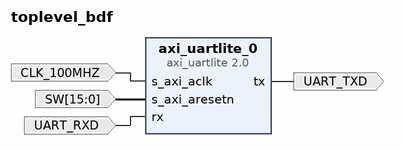
[diagram p0: block diagram of the top level]
# Vivado block design toplevel_bdf, xc7s50csga324-2, Vivado 2025.1
create_bd_design toplevel_bdf

create_bd_port -dir I -from 15 -to 0 -type data SW
create_bd_port -dir I -type clk CLK_100MHZ
set_property -dict {CONFIG.FREQ_HZ 100000000} [get_bd_ports CLK_100MHZ]
create_bd_port -dir O UART_TXD
create_bd_port -dir I UART_RXD

create_bd_cell -type ip -vlnv xilinx.com:ip:axi_uartlite:2.0 axi_uartlite_0
set_property -dict {CONFIG.C_BAUDRATE 115200} [get_bd_cells axi_uartlite_0]

# ---- connections ----

connect_bd_net [get_bd_ports CLK_100MHZ] [get_bd_pins axi_uartlite_0/s_axi_aclk]
connect_bd_net [get_bd_ports SW] [get_bd_pins axi_uartlite_0/s_axi_aresetn]
connect_bd_net [get_bd_ports UART_RXD] [get_bd_pins axi_uartlite_0/rx]
connect_bd_net [get_bd_pins axi_uartlite_0/tx] [get_bd_ports UART_TXD]

validate_bd_design
save_bd_design
